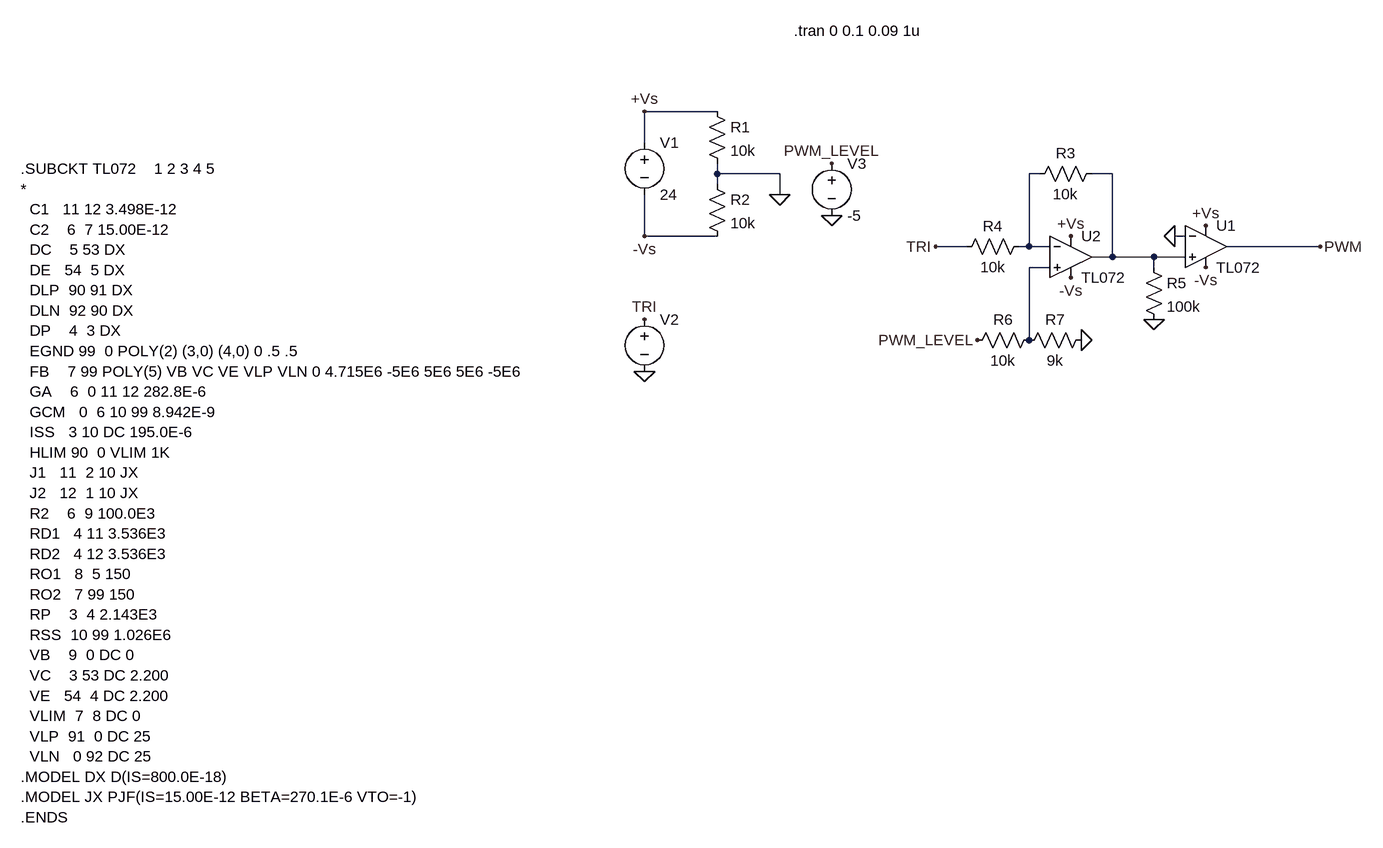
[diagram p0: schematic pwm.asc]
pwm.asc, the LTspice schematic file:
Version 4
SHEET 1 940 1052
WIRE -80 32 -192 32
WIRE -192 80 -192 32
WIRE -80 128 -80 112
WIRE 16 128 -80 128
WIRE 416 128 400 128
WIRE 528 128 496 128
WIRE -80 144 -80 128
WIRE 16 160 16 128
WIRE -192 224 -192 160
WIRE -80 224 -192 224
WIRE 640 224 624 224
WIRE 304 240 256 240
WIRE 400 240 400 128
WIRE 400 240 384 240
WIRE 432 240 400 240
WIRE 848 240 704 240
WIRE 528 256 528 128
WIRE 528 256 496 256
WIRE 592 256 528 256
WIRE 640 256 592 256
WIRE 432 272 400 272
WIRE 592 272 592 256
WIRE 400 384 400 272
FLAG -192 32 +Vs
FLAG -192 224 -Vs
FLAG 16 160 0
FLAG 672 272 -Vs
FLAG 672 208 +Vs
FLAG -192 432 0
FLAG 848 240 PWM
FLAG 624 224 0
FLAG 592 352 0
FLAG 96 192 0
FLAG 96 112 PWM_LEVEL
FLAG 464 224 +Vs
FLAG 464 288 -Vs
FLAG 480 384 0
FLAG 320 384 PWM_LEVEL
FLAG -192 352 TRI
FLAG 256 240 TRI
SYMBOL voltage -192 64 R0
WINDOW 123 0 0 Left 0
SYMATTR SpiceLine Rser=1 Cpar=1n
SYMATTR InstName V1
SYMATTR Value 24
SYMBOL res -96 16 R0
SYMATTR InstName R1
SYMATTR Value 10k
SYMBOL res -96 128 R0
SYMATTR InstName R2
SYMATTR Value 10k
SYMBOL OpAmps\\opamp2 672 176 R0
SYMATTR InstName U1
SYMATTR Value TL072
SYMBOL voltage -192 336 R0
WINDOW 3 24 96 Invisible 2
WINDOW 123 0 0 Left 0
WINDOW 39 0 0 Left 0
SYMATTR InstName V2
SYMATTR Value PULSE(-5 5 0 {0.5/400} {0.5/400} 0 {1/400})
SYMBOL res 576 256 R0
SYMATTR InstName R5
SYMATTR Value 100k
SYMBOL voltage 96 96 R0
WINDOW 123 0 0 Left 0
WINDOW 39 0 0 Left 0
SYMATTR InstName V3
SYMATTR Value -5
SYMBOL OpAmps\\opamp2 464 192 R0
SYMATTR InstName U2
SYMATTR Value TL072
SYMBOL res 512 112 R90
WINDOW 0 0 56 VBottom 2
WINDOW 3 32 56 VTop 2
SYMATTR InstName R3
SYMATTR Value 10k
SYMBOL res 400 224 R90
WINDOW 0 0 56 VBottom 2
WINDOW 3 32 56 VTop 2
SYMATTR InstName R4
SYMATTR Value 10k
SYMBOL res 304 400 R270
WINDOW 0 32 56 VTop 2
WINDOW 3 0 56 VBottom 2
SYMATTR InstName R6
SYMATTR Value 10k
SYMBOL res 384 400 R270
WINDOW 0 32 56 VTop 2
WINDOW 3 0 56 VBottom 2
SYMATTR InstName R7
SYMATTR Value 9k
TEXT -1152 120 Left 2 !.SUBCKT TL072    1 2 3 4 5\n*\n  C1   11 12 3.498E-12\n  C2    6  7 15.00E-12\n  DC    5 53 DX\n  DE   54  5 DX\n  DLP  90 91 DX\n  DLN  92 90 DX\n  DP    4  3 DX\n  EGND 99  0 POLY(2) (3,0) (4,0) 0 .5 .5\n  FB    7 99 POLY(5) VB VC VE VLP VLN 0 4.715E6 -5E6 5E6 5E6 -5E6\n  GA    6  0 11 12 282.8E-6\n  GCM   0  6 10 99 8.942E-9\n  ISS   3 10 DC 195.0E-6\n  HLIM 90  0 VLIM 1K\n  J1   11  2 10 JX\n  J2   12  1 10 JX\n  R2    6  9 100.0E3\n  RD1   4 11 3.536E3\n  RD2   4 12 3.536E3\n  RO1   8  5 150\n  RO2   7 99 150\n  RP    3  4 2.143E3\n  RSS  10 99 1.026E6\n  VB    9  0 DC 0\n  VC    3 53 DC 2.200\n  VE   54  4 DC 2.200\n  VLIM  7  8 DC 0\n  VLP  91  0 DC 25\n  VLN   0 92 DC 25\n.MODEL DX D(IS=800.0E-18)\n.MODEL JX PJF(IS=15.00E-12 BETA=270.1E-6 VTO=-1)\n.ENDS
TEXT 38 -92 Left 2 !.tran 0 0.1 0.09 1u

The netlist it stands for:
* pwm.asc
V1 +Vs -Vs 24 Rser=1 Cpar=1n
R1 +Vs 0 10k
R2 0 -Vs 10k
XU1 N002 0 +Vs -Vs PWM TL072  ; pins In+ In- V+ V- OUT
V2 TRI 0 PULSE(-5 5 0 {0.5/400} {0.5/400} 0 {1/400})
R5 N002 0 100k
V3 PWM_LEVEL 0 -5
XU2 N003 N001 +Vs -Vs N002 TL072  ; pins In+ In- V+ V- OUT
R3 N002 N001 10k
R4 N001 TRI 10k
R6 PWM_LEVEL N003 10k
R7 N003 0 9k
.SUBCKT TL072    1 2 3 4 5
*
  C1   11 12 3.498E-12
  C2    6  7 15.00E-12
  DC    5 53 DX
  DE   54  5 DX
  DLP  90 91 DX
  DLN  92 90 DX
  DP    4  3 DX
  EGND 99  0 POLY(2) (3,0) (4,0) 0 .5 .5
  FB    7 99 POLY(5) VB VC VE VLP VLN 0 4.715E6 -5E6 5E6 5E6 -5E6
  GA    6  0 11 12 282.8E-6
  GCM   0  6 10 99 8.942E-9
  ISS   3 10 DC 195.0E-6
  HLIM 90  0 VLIM 1K
  J1   11  2 10 JX
  J2   12  1 10 JX
  R2    6  9 100.0E3
  RD1   4 11 3.536E3
  RD2   4 12 3.536E3
  RO1   8  5 150
  RO2   7 99 150
  RP    3  4 2.143E3
  RSS  10 99 1.026E6
  VB    9  0 DC 0
  VC    3 53 DC 2.200
  VE   54  4 DC 2.200
  VLIM  7  8 DC 0
  VLP  91  0 DC 25
  VLN   0 92 DC 25
.MODEL DX D(IS=800.0E-18)
.MODEL JX PJF(IS=15.00E-12 BETA=270.1E-6 VTO=-1)
.ENDS
.tran 0 0.1 0.09 1u
.backanno
.end